# Altium schematic sheet instr_amp.SchDoc: Hall / Hub Board / Diff. Amp.
size A4; DocumentNumber: 5; SheetNumber: 5; SheetTotal: 7
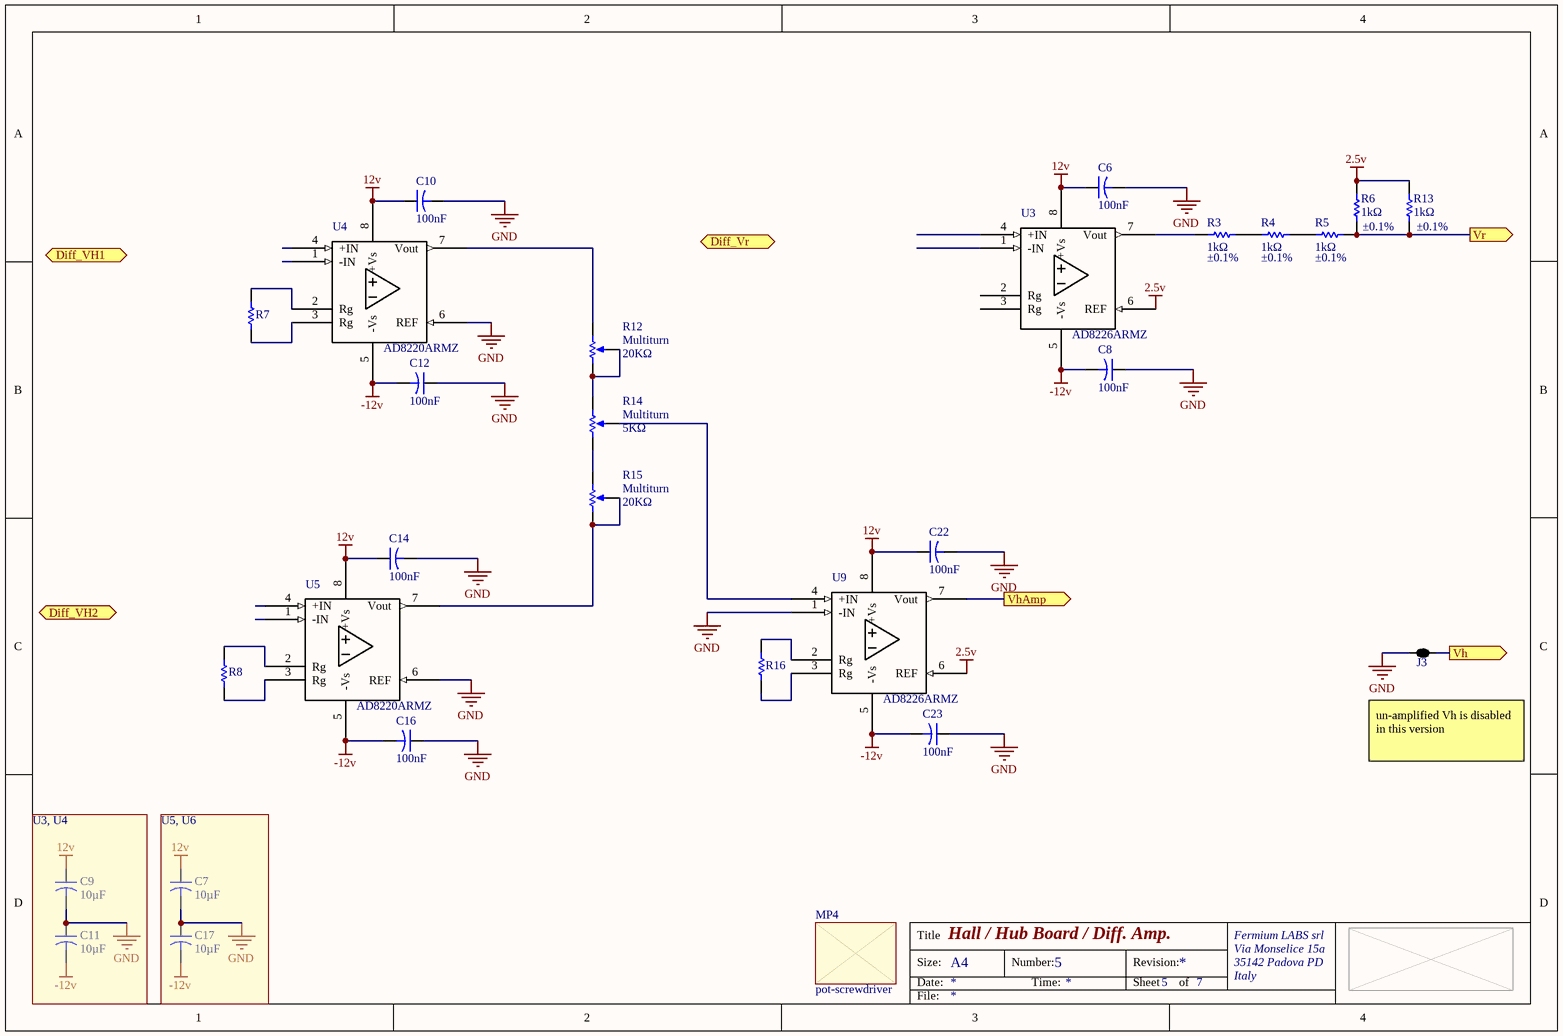
[diagram p0: instr_amp.SchDoc]

## Parts
C6  Capacitance: 100nF  [CAP 0805/2012]
C7  Capacitance: 10µF  [CAP 1206/3216]
C8  Capacitance: 100nF  [CAP 0805/2012]
C9  Capacitance: 10µF  [CAP 1206/3216]
C10  Capacitance: 100nF  [CAP 0805/2012]
C11  Capacitance: 10µF  [CAP 1206/3216]
C12  Capacitance: 100nF  [CAP 0805/2012]
C14  Capacitance: 100nF  [CAP 0805/2012]
C16  Capacitance: 100nF  [CAP 0805/2012]
C17  Capacitance: 10µF  [CAP 1206/3216]
C22  Capacitance: 100nF  [CAP 0805/2012]
C23  Capacitance: 100nF  [CAP 0805/2012]
J3  2 way net tie junction  [2way_LP]  (value not drawn)  (net tie, no BOM)
MP4  pot-screwdriver  (mechanical)
R3  Resistance: 1kΩ  Tolerance: ±0.1%  [RES 0805/2012]
R4  Resistance: 1kΩ  Tolerance: ±0.1%  [RES 0805/2012]
R5  Resistance: 1kΩ  Tolerance: ±0.1%  [RES 0805/2012]
R6  Resistance: 1kΩ  Tolerance: ±0.1%  [RES 0805/2012]
R7  (no value)  [RES 0805/2012]  (no BOM)
R8  (no value)  [RES 0805/2012]  (no BOM)
R12  Multiturn  Resistance: 20KΩ  [trimmer-multiturn]
R13  Resistance: 1kΩ  Tolerance: ±0.1%  [RES 0805/2012]
R14  Multiturn  Resistance: 5KΩ  [trimmer-multiturn]
R15  Multiturn  Resistance: 20KΩ  [trimmer-multiturn]
R16  (no value)  [RES 0805/2012]  (no BOM)
U3  Manufacturer Part Number: AD8226ARMZ  [MSOP_MO-187-AA AD8220]
U4  Supplier Part Number 1: AD8220ARMZ  [MSOP_MO-187-AA AD8220]
U5  Supplier Part Number 1: AD8220ARMZ  [MSOP_MO-187-AA AD8220]
U9  Manufacturer Part Number: AD8226ARMZ  [MSOP_MO-187-AA AD8220]

## Blocks framed on the sheet
U3, U4: C9 C11
U5, U6: C7 C17

## Ports
Diff_VH1 (harness Diff_VH1), Diff_VH2 (harness Diff_VH2), Diff_Vr (harness Diff_Vr), Vh (out), VhAmp (out), Vr (out)

## Nets
2.5v: R6.2 R13.2 U3.6(REF) U9.6(REF)
12v: C6.1 C7.1 C9.1 C10.1 C14.1 C22.1 U3.8(+Vs) U4.8(+Vs) U5.8(+Vs) U9.8(+Vs)
-12v: C8.2 C11.2 C12.2 C16.2 C17.2 C23.2 U3.5(-Vs) U4.5(-Vs) U5.5(-Vs) U9.5(-Vs)
GND: C6.2 C7.2 C8.1 C9.2 C10.2 C11.1 C12.1 C14.2 C16.1 C17.1 C22.2 C23.1 J3.1 U4.6(REF) U5.6(REF) U9.1(-IN)
Vh: J3.2 ; port Vh
VhAmp: U9.7(Vout) ; port VhAmp
Vr: R5.1 R6.1 R13.1 ; port Vr
NetR3_1: R3.1 R4.2
NetR3_2: R3.2 U3.7(Vout)
NetR4_1: R4.1 R5.2
NetR7_1: R7.1 U4.2(Rg)
NetR7_2: R7.2 U4.3(Rg)
NetR8_1: R8.1 U5.2(Rg)
NetR8_2: R8.2 U5.3(Rg)
NetR12_1: R12.1 R12.3 R14.2
NetR12_2: R12.2 U4.7(Vout)
NetR14_1: R14.1 R15.2
NetR14_3: R14.3 U9.4(+IN)
NetR15_1: R15.1 R15.3 U5.7(Vout)
NetR16_1: R16.1 U9.2(Rg)
NetR16_2: R16.2 U9.3(Rg)

Not connected (* = marked no-connect by the designer): U3 1(-IN) 2(Rg) 3(Rg) 4(+IN); U4 1(-IN) 4(+IN); U5 1(-IN) 4(+IN)

## Notes on the sheet
- (near J3) un-amplified Vh is disabled in this version
- Title
- Size:
- Date:
- A4
- Number:
- Time:
- Revision:
- Sheet
- of
- Fermium LABS srl
- Via Monselice 15a
- 35142 Padova PD
- Italy
- File:

## Library data of the parts
C6 C8 C10 C12 C14 C16 C22 C23 = Cap2: Capacitor; Manufacturer: YAGEO; Manufacturer Part Number: CC0805JRX7R9BB104; Unit: pcs; SuppliedAmount: 0; MinAmount: 100; Capacitor type: ceramic; Capacitor kind: MLCC; Operating voltage: 50V; Dielectric: X7R; Tolerance: ±5%; Case - inch: 0805; Case - mm: 2012; Pads: 2 SMD; Supplier 1: TME; Supplier Part Number 1: CC0805JRX7R9104; Category: 0805 MLCC SMD Capacitors; Stock 1: 89911; Pricing 1: 100=0.00613, 300=0.00464, 1000=0.00342, 4000=0.00284, 20000=0.00273 (EUR); Weight: 0.042; Multiples: 100; Mounting: SMD; Price Type: NET; ComponentLink1URL: http://static.tme.eu/products_pics/d/b/b/dbbd93eaf25225110ca26eb66da77328/58538.jpg; ComponentLink1Description: http://static.tme.eu/products_pics/d/b/b/dbbd93eaf25225110ca26eb66da77328/58538.jpg
C7 C9 C11 C17 = Cap2: Capacitor; Manufacturer: SAMSUNG; Manufacturer Part Number: CL31A106KAHNNNE; Unit: pcs; SuppliedAmount: 0; MinAmount: 100; Capacitor type: ceramic; Capacitor kind: MLCC; Operating voltage: 25V; Dielectric: X5R; Tolerance: ±10%; Case - inch: 1206; Case - mm: 3216; Pads: 2 SMD; Published: 23-Sep-2002; PackageReference: CAPR5-4X5; Publisher: Altium Limited; PackageDescription: 1206; Supplier 1: TME; Supplier Part Number 1: CL31A106KAHNNNE; Category: 1206 MLCC SMD Capacitors; Stock 1: 279700; Pricing 1: 100=0.0248, 300=0.0203, 1000=0.0167, 2000=0.0131, 10000=0.0127 (EUR); Weight: 0.061; Multiples: 100; Mounting: SMD; Operating temperature: -55...85°C; Price Type: NET; ComponentLink1URL: http://static.tme.eu/products_pics/b/e/9/be9e0dd298dcf4979ea1dd3d226e0bfa/58780.jpg; ComponentLink1Description: http://static.tme.eu/products_pics/b/e/9/be9e0dd298dcf4979ea1dd3d226e0bfa/58780.jpg
J3 = 2way: ComponentLink1URL: http://www.edatools.cz/addons; ComponentLink1Description: Source; FootprintNote: LP=12mil, MP=40mil, HP=120mil
MP4 = pot-screwdriver: Manufacturer Part Number: H-90; Manufacturer: BOURNS; Supplier 1: TME; Supplier Part Number 1: H-90
R3-R6 R13 = Res1: Resistor; Manufacturer: VIKING; Manufacturer Part Number: AR05BTCW1001; Manufacturer series: AR; Unit: pcs; SuppliedAmount: 0; MinAmount: 10; Kind of resistor: precise; Case - inch: 0805; Case - mm: 2012; Power: 0.125W; Max. operating voltage: 150V; Max. overload voltage: 300V; Temperature coefficient: 25ppm/°C; Pads: 2 SMD; Published: 8-Jun-2000; LatestRevisionDate: 17-Jul-2002; LatestRevisionNote: Re-released for DXP Platform.; PackageReference: AXIAL-0.3; Publisher: Altium Limited; PackageDescription: Axial Device, Thru-Hole; 2 Leads; 0.3 in Pin Spacing; Supplier 1: TME; Supplier Part Number 1: AR0805-1K-0.1%; Category: 0805 SMD Precision Resistors; Stock 1: 0; Pricing 1: 10=0.11211, 100=0.05707, 1000=0.03771, 5000=0.03176 (EUR); Weight: 0.034; Multiples: 10; Resistor type: thin film; Mounting: SMD; Operating temperature: -55...155°C; Price Type: NET; ComponentLink1URL: http://static.tme.eu/products_pics/6/6/c/66cc5cd64257edd80ca8e9fd2040972d/56038.jpg; ComponentLink1Description: http://static.tme.eu/products_pics/6/6/c/66cc5cd64257edd80ca8e9fd2040972d/56038.jpg; Supplier 2: TME; Supplier Part Number 2: AR0805-1K13-0.1%; Stock 2: 750; Pricing 2: 10=0.11119, 100=0.05661, 1000=0.0374, 5000=0.0315 (EUR)
R7 R8 R16 = Res1: Resistor; Pads: N/A
R12 R15 = RPot: Potentiometer; Manufacturer: SR PASSIVES; Manufacturer Part Number: T910X-20K; Pads: 3 THT; Supplier 1: TME; Supplier Part Number 1: T910X-20K
R14 = RPot: Potentiometer; Manufacturer: SR PASSIVES; Manufacturer Part Number: T910X-5K; Pads: 3 THT; Supplier 1: TME; Supplier Part Number 1: T910X-5K
U3 U9 = AD8226: Instrumentation amplifier; Manufacturer: Analog Devices; Supply Type: Single, Dual; Number of Channels: 1 Channel; 3 dB Bandwidth: 1.5 MHz; CMRR - Common Mode Rejection Ratio: 120 dB; Dual Supply Voltage: 1.35 V to 18 V; Gain V/V: 1 V/V to 1000 V/V; Ib - Input Bias Current: 35 nA; Maximum Input Resistance: 800 MOhms at +/- 15 V; Operating Supply Current: 325 uA; Operating Supply Voltage: 2.2 V to 36 V; SR - Slew Rate: 0.4 V/us; Supply Voltage - Max: 36 V; Supply Voltage - Min: 2.2 V; Voltage Gain dB: 60 dB; Vos - Input Offset Voltage: 100 uV; Pads: 8 SMD; Supplier 1: Mouser; Supplier Part Number 1: 584-AD8226ARMZ; RoHS: RoHS Compliant; Category: Instrumentation Amplifiers; Stock 1: 679; Pricing 1: 1=2.48, 10=2.22, 25=1.99, 50=1.87, 100=1.82, 250=1.64, 500=1.47, 1000=1.28 (EUR); Amplifier Type: Instrumentation Amplifier; Height: 0.85 mm; Length: 3 mm; Package / Case: MSOP-8; Packaging: Tube; Product: Instrumentation Amplifiers; Series: AD8226; Width: 3 mm; Brand: Analog Devices; Mounting Style: SMD/SMT; GBP - Gain Bandwidth Product: -; Maximum Operating Temperature: + 125 C; Minimum Operating Temperature: - 40 C; Standard Pack Qty: 50; Vcm - Common Mode Voltage: 2.2 V to 36 V; RoHS - Mouser: Y; Minimum Order Quantity: 1; Reeling: False; ComponentLink1URL: http://www.mouser.com/ds/2/609/AD8226-877720.pdf; ComponentLink1Description: http://www.mouser.com/ds/2/609/AD8226-877720.pdf
U4 U5 = AD8226: Instrumentation amplifier; Manufacturer: ANALOG DEVICES; Unit: pcs; SuppliedAmount: 0; MinAmount: 1; Integrated circuit type: operational amplifier; Transmission band frequency: 1.5MHz; Supply voltage: 4.5...36V DC; Slew rate: 2V/μs; Pads: 8 SMD; Supplier 1: TME; Manufacturer Part Number: AD8220ARMZ; Category: SMD Operational Amplifiers; Stock 1: 47; Pricing 1: 1=5.19, 3=4.91, 10=4.16, 25=3.87 (EUR); Weight: 3.79; Multiples: 1; Mounting: SMD; Number of channels: 1; Case: MSOP8; Operating temperature: -40...85°C; Price Type: NET; ComponentLink1URL: http://static.tme.eu/products_pics/5/3/1/531d7915b61678c8109674b14bfbf850/285547.jpg; ComponentLink1Description: http://static.tme.eu/products_pics/5/3/1/531d7915b61678c8109674b14bfbf850/285547.jpg